# EAGLE design Adafruit PCA9685 rev C (EAGLE 6.3)
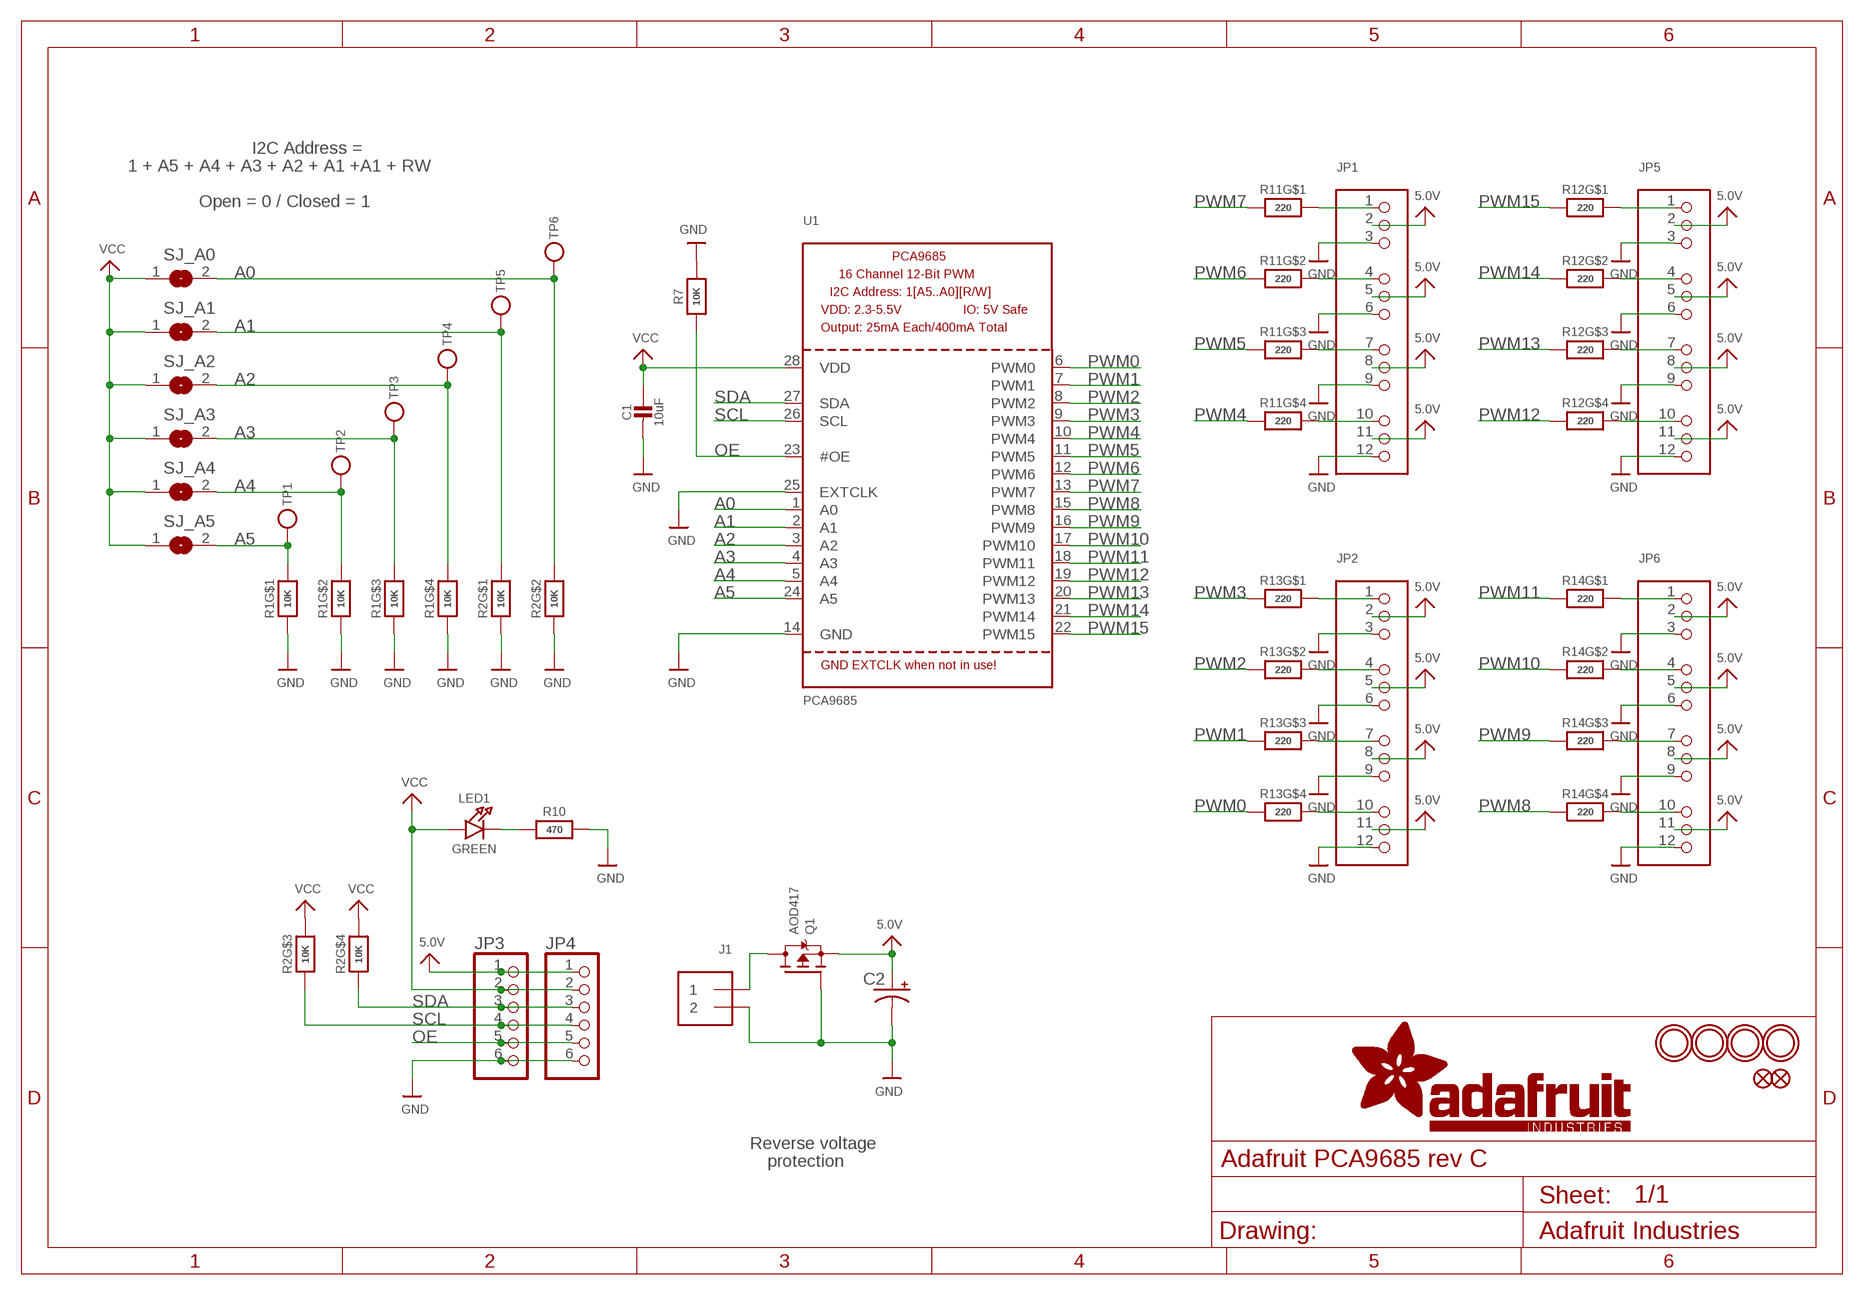
[diagram p0: schematic, sheet 1]

## Parts
C1  10uF  CAP_CERAMIC0805-NOOUTLINE  [0805-NO]
C2  CPOL-USE3.5-8  [E3,5-8]
FID1  FIDUCIAL""  [FIDUCIAL_1MM]
FID2  FIDUCIAL""  [FIDUCIAL_1MM]
J1  TERMBLOCK_1X2  [TERMBLOCK_1X2-3.5MM]
JP1  HEADER-3X04  [3X04]
JP2  HEADER-3X04  [3X04]
JP3  PINHD-1X6CB  [1X06-CLEANBIG]
JP4  PINHD-1X6CB  [1X06-CLEANBIG]
JP5  HEADER-3X04  [3X04]
JP6  HEADER-3X04  [3X04]
LED1  GREEN  LED0805_NOOUTLINE  [CHIPLED_0805_NOOUTLINE]
Q1  AOD417  MOSFET-PTO252  [TO252]
R1  10K  RESISTOR_4PACK  [RESPACK_4X0603]
R2  10K  RESISTOR_4PACK  [RESPACK_4X0603]
R7  10K  RESISTOR0805_NOOUTLINE  [0805-NO]
R10  470  RESISTOR_0805MP  [_0805MP]
R11  220  RESISTOR_4PACK  [RESPACK_4X0603]
R12  220  RESISTOR_4PACK  [RESPACK_4X0603]
R13  220  RESISTOR_4PACK  [RESPACK_4X0603]
R14  220  RESISTOR_4PACK  [RESPACK_4X0603]
SJ_A0  SOLDERJUMPERREFLOW_NOPASTE  [SOLDERJUMPER_REFLOW_NOPASTE]
SJ_A1  SOLDERJUMPERREFLOW_NOPASTE  [SOLDERJUMPER_REFLOW_NOPASTE]
SJ_A2  SOLDERJUMPERREFLOW_NOPASTE  [SOLDERJUMPER_REFLOW_NOPASTE]
SJ_A3  SOLDERJUMPERREFLOW_NOPASTE  [SOLDERJUMPER_REFLOW_NOPASTE]
SJ_A4  SOLDERJUMPERREFLOW_NOPASTE  [SOLDERJUMPER_REFLOW_NOPASTE]
SJ_A5  SOLDERJUMPERREFLOW_NOPASTE  [SOLDERJUMPER_REFLOW_NOPASTE]
TP1  TESTPOINTROUND1MM  [TESTPOINT_ROUND_1MM]
TP2  TESTPOINTROUND1MM  [TESTPOINT_ROUND_1MM]
TP3  TESTPOINTROUND1MM  [TESTPOINT_ROUND_1MM]
TP4  TESTPOINTROUND1MM  [TESTPOINT_ROUND_1MM]
TP5  TESTPOINTROUND1MM  [TESTPOINT_ROUND_1MM]
TP6  TESTPOINTROUND1MM  [TESTPOINT_ROUND_1MM]
U1  PCA9685  [TSSOP28]
U$47  MOUNTINGHOLE2.5  [MOUNTINGHOLE_2.5_PLATED]
U$48  MOUNTINGHOLE2.5  [MOUNTINGHOLE_2.5_PLATED]
U$49  MOUNTINGHOLE2.5  [MOUNTINGHOLE_2.5_PLATED]
U$50  MOUNTINGHOLE2.5  [MOUNTINGHOLE_2.5_PLATED]

## Nets
5.0V: C2.+ JP1.2 JP1.5 JP1.8 JP1.11 JP2.2 JP2.5 JP2.8 JP2.11 JP3.1 JP4.1 JP5.2 JP5.5 JP5.8 JP5.11 JP6.2 JP6.5 JP6.8 JP6.11 Q1.2(S)
A0: R2.7 SJ_A0.2 TP6.P$1 U1.1(A0)
A1: R2.8 SJ_A1.2 TP5.P$1 U1.2(A1)
A2: R1.5 SJ_A2.2 TP4.P$1 U1.3(A2)
A3: R1.6 SJ_A3.2 TP3.P$1 U1.4(A3)
A4: R1.7 SJ_A4.2 TP2.P$1 U1.5(A4)
A5: R1.8 SJ_A5.2 TP1.P$1 U1.24(A5)
GND: C1.2 C2.- J1.2 JP1.3 JP1.6 JP1.9 JP1.12 JP2.3 JP2.6 JP2.9 JP2.12 JP3.6 JP4.6 JP5.3 JP5.6 JP5.9 JP5.12 JP6.3 JP6.6 JP6.9 JP6.12 Q1.1(G) R1.1 R1.2 R1.3 R1.4 R2.1 R2.2 R7.2 R10.2 U1.14(GND) U1.25(EXTCLK)
N$1: LED1.C R10.1
N$2: JP1.4 R11.7
N$3: JP1.1 R11.8
N$4: JP1.7 R11.6
N$5: JP1.10 R11.5
N$6: JP2.1 R13.8
N$7: JP2.4 R13.7
N$8: JP2.7 R13.6
N$9: JP2.10 R13.5
N$10: JP6.10 R14.5
N$11: JP6.7 R14.6
N$12: JP6.4 R14.7
N$13: JP6.1 R14.8
N$14: JP5.10 R12.5
N$15: JP5.7 R12.6
N$16: JP5.4 R12.7
N$17: JP5.1 R12.8
OE: JP3.5 JP4.5 R7.1 U1.23(#OE)
PWM0: R13.4 U1.6(PWM0)
PWM1: R13.3 U1.7(PWM1)
PWM2: R13.2 U1.8(PWM2)
PWM3: R13.1 U1.9(PWM3)
PWM4: R11.4 U1.10(PWM4)
PWM5: R11.3 U1.11(PWM5)
PWM6: R11.2 U1.12(PWM6)
PWM7: R11.1 U1.13(PWM7)
PWM8: R14.4 U1.15(PWM8)
PWM9: R14.3 U1.16(PWM9)
PWM10: R14.2 U1.17(PWM10)
PWM11: R14.1 U1.18(PWM11)
PWM12: R12.4 U1.19(PWM12)
PWM13: R12.3 U1.20(PWM13)
PWM14: R12.2 U1.21(PWM14)
PWM15: R12.1 U1.22(PWM15)
PWRIN: J1.1 Q1.3(D)
SCL: JP3.4 JP4.4 R2.3 U1.26(SCL)
SDA: JP3.3 JP4.3 R2.4 U1.27(SDA)
VCC: C1.1 JP3.2 JP4.2 LED1.A R2.5 R2.6 SJ_A0.1 SJ_A1.1 SJ_A2.1 SJ_A3.1 SJ_A4.1 SJ_A5.1 U1.28(VDD)

## Notes on the sheet
- I2C Address =
- 1 + A5 + A4 + A3 + A2 + A1 +A1 + RW
- Open = 0 / Closed = 1
- Reverse voltage
- protection

## Library data of the parts
C1 = microbuilder:CAP_CERAMIC: Ceramic Capacitors For new designs, use the packages preceded by an '_' character since they are more reliable: The following footprints should be used on most boards: _0402 - Standard footprint for regular board layouts _0603 - Standard footprint for regular board layouts _0805 - Standard footprint for regular board layouts _1206 - Standard footprint for regular board layouts For extremely tight-pitch boards where space is at a premium, the following 'micro-pitch' footprints can be used (smaller pads, no silkscreen outline, etc.): _0402MP - Micro-pitch footprint for very dense/compact boards _0603MP - Micro-pitch footprint for very dense/compact boards _0805MP - Micro-pitch footprint for very dense/compact boards _1206MP - Micro-pitch footprint for very dense/compact boards
C2 = adafruit:CPOL-US: POLARIZED CAPACITOR, American symbol
FID1 FID2 = microbuilder:FIDUCIAL: Fiducial Alignment Points Various fiducial points for machine vision alignment.; BOM: EXCLUDE
J1 = microbuilder:TERMBLOCK_1X2: 3.5mm Terminal block http://www.ladyada.net/library/pcb/eaglelibrary.html
JP1 JP2 JP5 JP6 = microbuilder:HEADER-3X04
JP3 JP4 = adafruit:PINHD-1X6: PIN HEADER
LED1 = microbuilder:LED: LED 0603 - 0603 Surface Mount Package 2mA: Green LED - Low Power (3.9mcd, 2ma, 1.7Vf) - Digikey: 475-2709-2-ND Orange LED - Low Power (9.8mcd, 2ma, 1.8Vf) - Digikey: 475-1194-2-ND Red LED - Low Power (5mcd, 2ma, 1.8Vf) - Digikey: 475-1195-2-ND Yellow LED - Low Power (7mcd, 2ma, 1.8Vf) - Digikey: 475-1196-2-ND 5mA: Blue LED - Low Power (17mcd, 5ma, 2.9Vf) - Digikey: LNJ937W8CRACT-ND 0805 - 0805 Surface Mount Package 2mA: Red LED (8.8mcd, 2mA, 1.8Vf, Clear) - Low Power [Digikey: 475-2510-1-ND] Green LED (5mcd, 2mA, 1.8Vf, Clear) - Low Power [Digikey: 475-2730-1-ND] Yellow LED (11.3mcd, 2mA, 1.8Vf, Clear) - Low Power [Digikey: 475-2555-1-ND] 20mA: Red LED (104mcd, 20mA, Diffused) - LS R976 [Digikey: 475-1278-6-ND] Red LED (12mcd, 20mA, 2.0Vf, Clear) - APT2012EC [Digikey: 754-1128-1-ND] Green LED (15mcd, 20mA, 2.2Vf, Clear) - APT2012GC [Digikey: 754-1131-1-ND] Orange LED (160mcd, 20mA, 2.1Vf, Clear) - APT2012SECK [Digikey: 754-1130-1-ND] 1206 - 1206 Surface Mount Package Green LED (26mcd, 20mA, Diffused) - LG N971 [Digikey: 475-1407-6-ND] Red LED (15mcd, 20mA, Diffused) - LH N974 [Digikey: 475-1416-6-ND] Cree - Cree High-Power Surface Mount LEDs XPEBWT-L1-0000-00D50 - White 111lm 350mA 2.9Vf 6200K 110° XTEAWT-00-0000-00000LEE3 - White 114lm 350mA 2.85Vf 5000K 115° Everlight - Everlight 45-21 Series Surface Mount LEDs 45-21/QK2C-B2832AC2CB2/2T - Warm White 2000mcd 20mA 3.25Vf 3050K 120° 45-21/LK2C-B38452C4CB2/2T - Nuetral White 2000mcd 20mA 3.25Vf 4150K 120° 45-21/LK2C-B50634C6CB2/2T - Cold White 2200mcd 20mA 3.25Vf 5650K 120° PLCC2 Reverse Mount LS T77K-J1L2-1-0-2-R18-Z - Red 11.25mcd 2mA 1.8Vf 630nm 120° LO T77K-L1M2-24-Z - Orange 19.6mcd 2mA 1.8Vf 606nm 120° LY T77K-K2M1-26-Z - Yellow 15.7mcd 2mA 1.8Vf 587nm 120°
Q1 = microbuilder:MOSFET-P: P-Channel Mosfet LEGEND VDS: Voltage Drain-Source ID: Drain Current RDS(ON): Drain-Source On-State Resistance VGS(TH): Gate-Source Threshold Voltage CISS: Drain-Source Input Capacitance SOT-23 Name VDS ID RDS(ON) VGS(TH) CISS Order Number IRLML5103 30V 760mA 600 mOhm -- 75pF @ 25V Digikey: IRLML5103PBFCT-ND IRLML6401 12V 4.3A 50 mOhm 950mV @ 250µA 830pF @ 10V Digikey: IRLML6401PBFTR-ND NTR0202PL 20V 400mA 800 mOhm 2.3V @ 250uA 70pF @ 5V Digikey: NTR0202PLT1GOSTR-ND NTR4101PT1G 20V 1.8A 85 mOhm 1.2V @ 250uA 675pF @ 10V Digikey: NTR4101PT1GOSCT-ND DMP2004K 20V 600mA 900 mOhm 1V @ 250uA 175pF @ 16V Digikey: DMP2004KDICT-ND PMV65XP 20V 3.9A 76 mOhm 950mV @ 1mA 725pF @ 20V Digikey: 568-2358-2-ND TO-252 Name VDS ID RDS(ON) VGS(TH) CISS Order Number AOD417 30V 25A 34 mOhm 3V @ 250µA 920pF @ 15V Digikey: 785-1106-2-ND
R1 R2 R11-R14 = microbuilder:RESISTOR_4PACK: Resistor Packs (4 resistors) 4 x 0603 10K 1/16W - Digikey: YC164J-10KCT-ND
R7 R10 = microbuilder:RESISTOR: Resistors For new designs, use the packages preceded by an '_' character since they are more reliable: The following footprints should be used on most boards: _0402 - Standard footprint for regular board layouts _0603 - Standard footprint for regular board layouts _0805 - Standard footprint for regular board layouts _1206 - Standard footprint for regular board layouts For extremely tight-pitch boards where space is at a premium, the following 'micro-pitch' footprints can be used (smaller pads, no silkscreen outline, etc.): _0402MP - Micro-pitch footprint for very dense/compact boards _0603MP - Micro-pitch footprint for very dense/compact boards _0805MP - Micro-pitch footprint for very dense/compact boards _1206MP - Micro-pitch footprint for very dense/compact boards
SJ_A0 SJ_A1-SJ_A5 = microbuilder:SOLDERJUMPER: SMD Solder JUMPER Solder the two pads together to create a connection, or remove the solder to break it. REFLOW - Use this footprint for solder paste and reflow ovens. WAVE - Use this footprint for hand-soldering (larger pads). CLOSED - Has a trace between the two pads to ensure it is closed by default. The trace needs to be cut to disable the jumper, and can be closed again by creating a solder bridge between the two pads.
TP1-TP6 = microbuilder:TESTPOINT: Test Point Various test points for characterisation and PCB testing TESTPOINT_SMT - Compact Surface Mount Test Point [Digikey: 5016KTR-ND]
U1 = microbuilder:PCA9685: PCA9685 - 16 Channel 12-Bit I2C PWM Controller 5.0V tolerant 16 channel, 12-bit I2C PWM controller with 25mA per output (max. 400mA total) Digikey: 568-5931-1-ND
U$47-U$50 = microbuilder:MOUNTINGHOLE: Mounting Hole For #2 screws (0.086"/2.18mm width, 0.094"/2.4mm hole) use 2.5mm; BOM: EXCLUDE

## Board
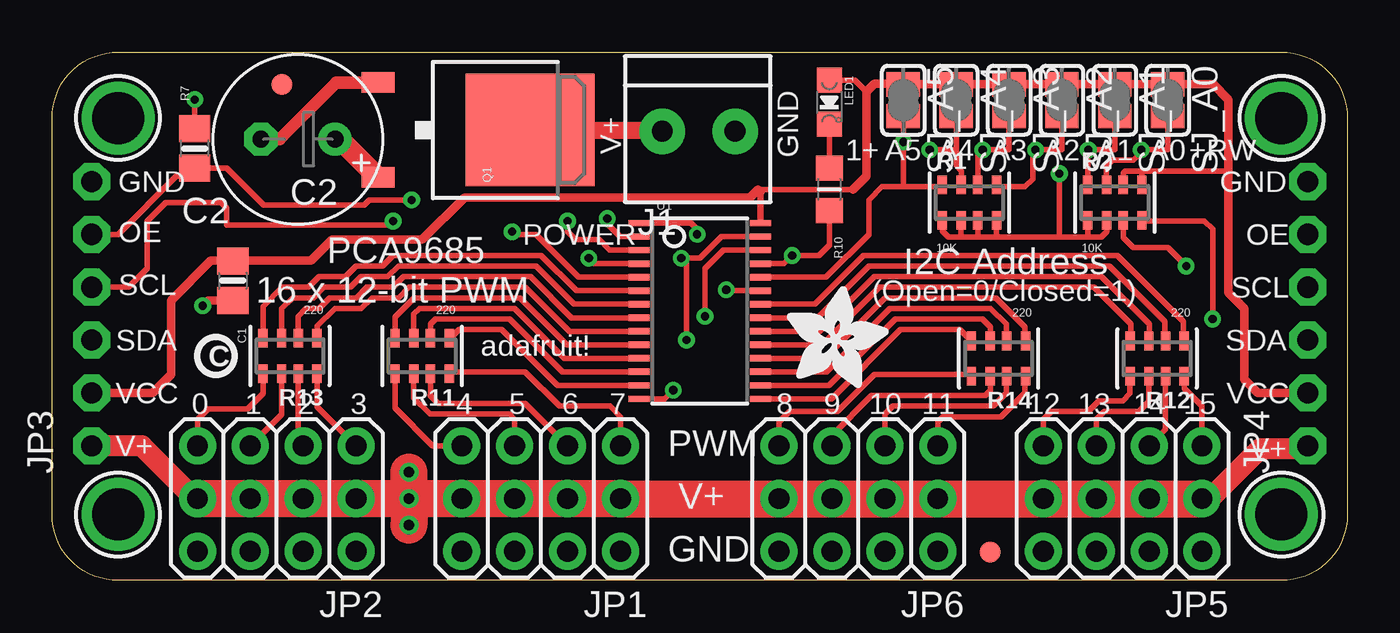
[diagram p1: board, top side]
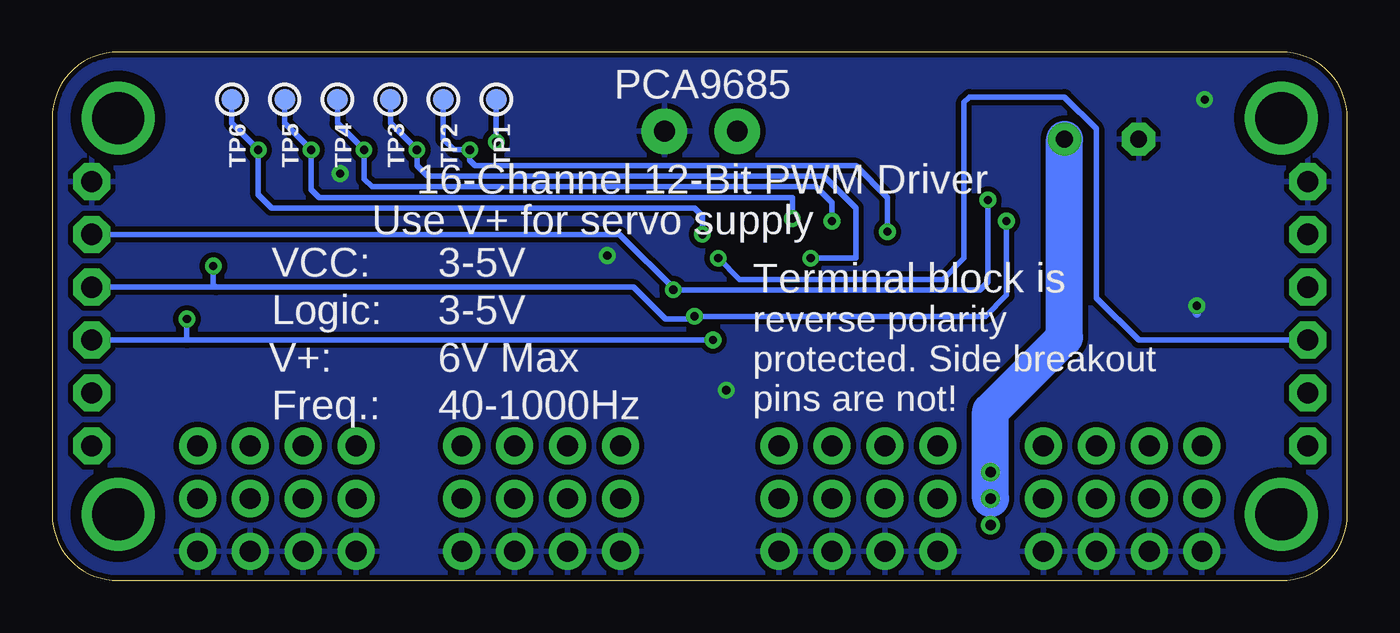
[diagram p2: board, bottom side, seen from below]

Size 62.23 x 25.4 mm. Coordinates in mm from the lower left corner, seen from the top.
Outline: 3.17,0 arc-90 0,3.18 0,22.23 arc-90 3.17,25.4 59.05,25.4 arc-90 62.23,22.23 62.23,3.18 arc-90 59.05,0 3.17,0
Copper layers (1*16): Top 0.035mm / dielectric 1.5mm / Bottom 0.035mm
Design rules "adafruit": minimum track width 8mil, minimum drill 15.5mil, track to track 8mil, track to pad 8mil, pad to pad 8mil, via to via 8mil, smd to smd 8mil, copper to edge 10mil, drill to drill 8mil, minimum pad ring 10mil, minimum via ring 8mil, stop-mask expansion 2mil, vias tented up to drill 20mil, thermal gap 10mil

### Footprints (pad centres in the part's own frame; a part is rotated, then mirrored left to right if it is on the bottom)
0805-NO = smd 1.3 x 1.5: 1 -0.95,0; 2 0.95,0
E3,5-8 = drill 0.813 pad 1.6: + -1.778,0 | drill 0.813 pad 1.6 octagon: - 1.778,0
FIDUCIAL_1MM = smd 1 x 1: 1 0,0
TERMBLOCK_1X2-3.5MM = drill 1 pad 2.184: 1 1.8,0; 2 -1.7,0
3X04 = drill 1 pad 1.778: 1 -3.81,-2.54; 2 -3.81,0; 3 -3.81,2.54; 4 -1.27,-2.54; 5 -1.27,0; 6 -1.27,2.54; 7 1.27,-2.54; 8 1.27,0; 9 1.27,2.54; 10 3.81,-2.54; 11 3.81,0; 12 3.81,2.54
1X06-CLEANBIG = drill 1.016 pad 1.778 octagon: 1 -6.35,0; 2 -3.81,0; 3 -1.27,0; 4 1.27,0; 5 3.81,0; 6 6.35,0
CHIPLED_0805_NOOUTLINE = smd 1.2 x 1.2: A 0,-1.05; C 0,1.05
TO252 = smd 1 x 1.6: 1 -2.28,-4.8; 2 2.28,-4.8 | smd 5.4 x 6.2: 3 0,2.5
RESPACK_4X0603 = smd 0.45 x 0.9: 1 -1.3,-0.85; 2 -0.4,-0.85; 3 0.4,-0.85; 4 1.3,-0.85; 5 1.3,0.85; 6 0.4,0.85; 7 -0.4,0.85; 8 -1.3,0.85
_0805MP = smd 1.2 x 1.3: 1 -1.016,0; 2 1.016,0
SOLDERJUMPER_REFLOW_NOPASTE = smd 1.168 x 1.6: 1 -0.762,0; 2 0.762,0
TESTPOINT_ROUND_1MM = smd 1 x 1: P$1 0,0
TSSOP28 = smd 0.305 x 0.991: 1 -4.225,-2.918; 2 -3.575,-2.918; 3 -2.925,-2.918; 4 -2.275,-2.918; 5 -1.625,-2.918; 6 -0.975,-2.918; 7 -0.325,-2.918; 8 0.325,-2.918; 9 0.975,-2.918; 10 1.625,-2.918; 11 2.275,-2.918; 12 2.925,-2.918; 13 3.575,-2.918; 14 4.225,-2.918; 15 4.225,2.918; 16 3.575,2.918; 17 2.925,2.918; 18 2.275,2.918; 19 1.625,2.918; 20 0.975,2.918; 21 0.325,2.918; 22 -0.325,2.918; 23 -0.975,2.918; 24 -1.625,2.918; 25 -2.275,2.918; 26 -2.925,2.918; 27 -3.575,2.918; 28 -4.225,2.918
MOUNTINGHOLE_2.5_PLATED = drill 2.5 pad 3.2: P$1 0,0

### Placement (x,y rotation side)
C1  8.68,14.41 270 top
C2  11.81,21.21 180 top
FID1  45.07,1.37 0 top
FID2  11.05,23.85 0 top
J1  31.12,21.59 180 top
JP1  23.5,3.94 180 top
JP2  10.79,3.94 180 top
JP3  1.91,12.83 90 top
JP4  60.33,12.83 90 top
JP5  51.44,3.94 180 top
JP6  38.73,3.94 180 top
LED1  37.34,22.99 180 top
Q1  20.46,21.66 270 top
R1  44.07,18.16 0 top
R2  51.05,18.16 0 top
R7  6.86,20.76 90 top
R10  37.34,18.8 270 top
R11  17.78,10.79 180 top
R12  53.09,10.67 180 top
R13  11.43,10.79 180 top
R14  45.47,10.67 180 top
SJ_A0  53.59,23.08 270 top
SJ_A1  51.05,23.08 270 top
SJ_A2  48.51,23.08 270 top
SJ_A3  45.97,23.08 270 top
SJ_A4  43.43,23.08 270 top
SJ_A5  40.89,23.08 270 top
TP1  40.89,23.11 270 bottom
TP2  43.43,23.11 270 bottom
TP3  45.97,23.11 270 bottom
TP4  48.51,23.11 270 bottom
TP5  51.05,23.11 270 bottom
TP6  53.59,23.11 270 bottom
U1  31.12,12.95 270 top
U$47  3.17,22.23 0 top
U$48  3.17,3.18 0 top
U$49  59.05,22.23 0 top
U$50  59.05,3.18 0 top
U$51  [ADAFRUIT_5MM]  35.31,9.27 0 top
U$54  [PCBFEAT-REV-040]  7.87,10.79 0 top

### Tracks (layer width: path | path; a pad name or v marks a point on that pad's centre or on a via)
5.0V  (via drill 0.5)
  Top 0.254: JP2.11 6.86,3.94 | JP5.2 55.63,3.94
  Top 1.016: JP3.1 4.32,6.48 6.86,3.94 | 55.63,3.94 58.04,6.35 60.2,6.35 JP4.1 | Q1.2 13.83,21.21 C2.+
  Top 1.778: JP2.11 JP2.8 JP2.5 JP2.2 v17.14,3.94 | v17.14,3.94 JP1.11 JP1.8 JP1.5 JP1.2 JP6.11 JP6.8 JP6.5 JP6.2 JP5.11 JP5.8 JP5.5 JP5.2 | v17.14,3.94 v17.14,5.21 | v17.14,3.94 v17.14,2.67
  Bottom 1.778: C2.+ 13.59,11.68 17.14,8.13 v17.14,3.94
A0  (via drill 0.39)
  Top 0.254: SJ_A0.2 53.59,20.7 v52.32,20.7 52.32,20.57 51.94,20.19 50.93,20.19 50.65,19.92 R2.7 | v30.99,16.64 30.99,16.89 30.7,17.18 U1.1
  Bottom 0.254: v30.99,16.64 30.99,17.53 31.37,17.91 51.69,17.91 52.32,18.54 v52.32,20.7 53.59,21.97 TP6.P$1
A1  (via drill 0.39)
  Top 0.254: SJ_A1.2 51.05,20.7 v49.78,20.7 49.75,20.67 R2.8 | U1.2 27.29,16.53 26.67,17.14 v26.67,17.4
  Bottom 0.254: v26.67,17.4 26.67,18.41 49.4,18.41 49.78,18.8 v49.78,20.7 51.05,21.97 TP5.P$1
A2  (via drill 0.39)
  Top 0.254: SJ_A2.2 48.51,20.7 v47.24,20.7 47.12,20.57 47.12,19.3 46.74,18.92 45.46,18.92 R1.5 | U1.3 26.79,15.88 26.29,16.38 25.15,16.38 24.77,16.76 v24.77,17.27
  Bottom 0.254: v24.77,17.27 24.77,18.16 25.53,18.92 46.86,18.92 47.24,19.3 v47.24,20.7 48.51,21.97 TP4.P$1
A3  (via drill 0.39)
  Top 0.254: SJ_A3.2 45.97,20.7 v44.7,20.7 44.47,20.47 R1.6 | U1.4 26.05,15.23 v25.78,15.49
  Bottom 0.254: v25.78,15.49 23.62,15.49 23.62,17.91 25.15,19.43 44.2,19.43 44.7,19.94 v44.7,20.7 45.97,21.97 TP3.P$1
A4  (via drill 0.39)
  Top 0.254: 43.43,20.7 SJ_A4.2 | v42.16,20.7 43.43,20.7 | U1.5 25.3,14.58 23.24,16.64 22.23,16.64 v22.1,16.76 | 43.43,20.7 43.43,19.94 43.69,19.69 43.69,19.03 R1.7
  Bottom 0.254: v22.1,16.76 22.1,18.41 23.62,19.94 41.91,19.94 42.16,20.19 v42.16,20.7 42.93,20.7 43.43,21.21 TP2.P$1
A5  (via drill 0.39)
  Top 0.254: U1.24 37.19,14.58 39.24,16.64 39.24,18.29 39.88,18.92 40.89,18.92 | SJ_A5.2 v40.89,21.08 40.89,18.92 | 40.89,18.92 42.68,18.92 R1.8
  Bottom 0.254: TP1.P$1 v40.89,21.08
GND  (via drill 0.39)
  Top 0.254: v6.86,23.11 R7.2 | U1.14 29.43,8.73 v29.85,9.14 | U1.25 35.17,15.23 v35.56,15.62 36.83,15.62 37.34,16.13 R10.2 | R1.1 42.77,16.79 43.05,16.51 43.69,16.51 | 43.69,16.51 44.45,16.51 | 44.45,16.51 45.47,16.51 | 45.47,16.51 48.39,16.51 | 48.39,16.51 49.78,16.51 | 49.78,16.51 50.42,16.51 50.67,16.76 50.67,17.29 R2.2 | v48.39,19.56 48.39,16.51 | R2.1 49.75,16.54 49.78,16.51 | R1.2 43.67,16.53 43.69,16.51 | R1.3 44.47,16.53 44.45,16.51 | R1.4 45.37,16.61 45.47,16.51
  Top 0.406: C1.2 7.5,13.46 v7.24,13.21
  Top 0.61: Q1.1 13.65,23.93 10.92,21.21 C2.-
  Bottom 0.254: v35.56,15.62 35.81,15.62
  Bottom 0.406: v7.24,13.21 7.24,12.83
  pour Bottom (isolate 0.254): 0,0 0,25.94 62.78,25.94 62.78,0
N$1
  Top 0.254: R10.1 LED1.C
N$2
  Top 0.254: JP1.4 22.73,8.51 18.54,8.51 18.16,8.89 18.18,8.91 R11.7
N$3
  Top 0.254: JP1.1 27.3,7.87 26.8,8.38 24.38,8.38 22.73,10.03 19.17,10.03 R11.8
N$4
  Top 0.254: JP1.7 22.23,7.75 21.97,8 18.16,8 17.38,8.78 R11.6
N$5
  Top 0.254: JP1.10 18.29,6.48 16.48,8.29 R11.5
N$6
  Top 0.254: JP2.1 12.73,8.35 R13.8
N$7
  Top 0.254: R13.7 11.83,6.71 JP2.4
N$8
  Top 0.254: R13.6 11.03,7.98 JP2.7
N$9
  Top 0.254: R13.5 10.13,8.99 9.4,8.26 7.49,8.26 6.99,7.75 JP2.10
N$10
  Top 0.254: JP6.10 34.93,7.62 35.43,8.13 37.72,8.13 39.5,9.91 44.17,9.91 R14.5
N$11
  Top 0.254: JP6.7 37.47,6.99 39.37,8.89 44.83,8.89 45.09,9.14 45.09,9.8 R14.6
N$12
  Top 0.254: JP6.4 40.01,8 40.39,8.38 45.21,8.38 45.85,9.02 45.85,9.8 R14.7
N$13
  Top 0.254: JP6.1 42.55,7.62 42.8,7.87 45.59,7.87 46.74,9.02 46.74,9.79 R14.8
N$14
  Top 0.254: R12.5 51.79,8.99 51.44,8.64 50.29,8.64 49.78,8.13 48.01,8.13 47.62,7.75 JP5.10
N$15
  Top 0.254: R12.6 52.69,8.62 52.2,8.13 50.55,8.13 50.16,7.75 JP5.7
N$16
  Top 0.254: R12.7 53.49,7.26 JP5.4
N$17
  Top 0.254: JP5.1 55.25,8.38 54.39,9.24 R12.8
OE  (via drill 0.39)
  Top 0.254: JP3.5 3.17,16.64 5.97,19.43 6.86,19.43 | U1.23 32.43,13.93 v32.38,13.97 | 6.98,19.43 6.86,19.43 | 6.86,19.43 R7.1 8.38,19.81 10.16,18.04 14.98,18.04 15.23,18.29 v17.27,18.29
  Bottom 0.254: JP4.5 34.97,16.64 32.26,13.93 32.43,13.93 v32.38,13.97 17.65,13.97 17.27,14.35 v17.27,18.29
PWM0
  Top 0.254: U1.6 25.19,13.93 23.5,15.62 16.38,15.62 15.88,15.11 14.6,15.11 14.1,14.61 12.83,14.61 12.32,14.1 11.05,14.1 10.13,13.18 R13.4
PWM1
  Top 0.254: U1.7 25.08,13.28 23.24,15.11 16.64,15.11 16.13,14.61 14.86,14.61 14.35,14.1 13.08,14.1 12.57,13.59 11.56,13.59 11.03,13.06 R13.3
PWM2
  Top 0.254: U1.8 24.96,12.63 22.99,14.61 16.89,14.61 16.38,14.1 15.11,14.1 14.6,13.59 13.33,13.59 12.83,13.08 12.19,13.08 11.81,12.7 11.83,12.68 R13.2
PWM3
  Top 0.254: U1.9 24.85,11.98 22.73,14.1 17.14,14.1 16.64,13.59 15.37,13.59 14.86,13.08 13.59,13.08 12.73,12.22 R13.1
PWM4
  Top 0.254: U1.10 24.74,11.33 22.48,13.59 17.4,13.59 16.48,12.67 R11.4
PWM5
  Top 0.254: U1.11 24.63,10.68 22.23,13.08 17.65,13.08 17.38,12.81 R11.3
PWM6
  Top 0.254: U1.12 24.52,10.03 21.97,12.57 18.42,12.57 18.18,12.34 R11.2
PWM7
  Top 0.254: U1.13 24.28,9.38 21.59,12.07 19.56,12.07 19.08,11.59 R11.1
PWM8
  Top 0.254: U1.15 37.43,8.73 40.77,12.07 43.62,12.07 R14.4
PWM9
  Top 0.254: U1.16 37.32,9.38 40.51,12.57 44.7,12.57 45.09,12.19 45.09,11.54 R14.3
PWM10
  Top 0.254: U1.17 37.21,10.03 40.26,13.08 45.09,13.08 45.85,12.32 45.85,11.54 R14.2
PWM11
  Top 0.254: U1.18 37.09,10.68 40.01,13.59 45.34,13.59 46.74,12.19 46.74,11.55 R14.1
PWM12
  Top 0.254: U1.19 36.98,11.33 39.75,14.1 50.04,14.1 51.82,12.32 51.82,11.55 R12.4
PWM13
  Top 0.254: U1.20 36.87,11.98 39.5,14.61 50.42,14.61 52.7,12.32 52.7,11.54 R12.3
PWM14
  Top 0.254: U1.21 36.76,12.63 39.24,15.11 50.8,15.11 53.47,12.45 53.47,11.54 R12.2
PWM15
  Top 0.254: U1.22 36.65,13.28 38.99,15.62 51.18,15.62 54.36,12.45 54.36,11.55 R12.1
PWRIN
  Top 0.813: Q1.3 29.25,21.66 J1.1
SCL  (via drill 0.39)
  Top 0.254: JP3.4 3.68,14.1 4.57,14.99 4.57,17.27 5.46,18.16 8.13,18.16 8.38,17.91 8.38,17.09 16.21,17.09 v16.38,17.27 | v31.37,12.7 31.37,14.99 32.26,15.88 U1.26 | R2.3 51.45,16.49 51.94,16 53.59,16 v54.48,15.11
  Bottom 0.254: 54.36,14.1 34.29,14.1 32.77,12.57 31.5,12.57 v31.37,12.7 17.4,12.7 16.38,13.72 v16.38,17.27 | 54.36,14.1 JP4.4 | v54.48,15.11 54.48,14.22 54.36,14.1
SDA  (via drill 0.39)
  Top 0.254: U1.27 32.15,16.53 31.12,15.49 v30.23,15.49 30.48,15.24 v30.48,11.56 | v55.75,12.57 55.75,16.89 55.36,17.28 52.38,17.28 R2.4
  Bottom 0.254: v30.48,11.56 55.75,11.56 | 55.75,11.56 JP4.3 | JP3.3 10.03,11.56 12.06,13.59 12.06,21.72 13.59,23.24 18.16,23.24 18.42,22.99 18.42,15.49 19.43,14.48 29.21,14.48 v30.23,15.49 | v55.75,12.57 55.75,11.56
VCC
  Top 0.254: 33.91,18.8 38.48,18.8 | R2.6 51.45,19.58 51.56,19.69 52.32,19.69 | 52.32,19.69 56.39,19.69 56.52,19.56 | R2.5 52.35,19.66 52.32,19.69 | LED1.A 38.57,24.04 39.12,23.5
  Top 0.305: 34.03,18.67 U1.28
  Top 0.406: JP3.2 4.83,9.02 5.71,9.91 5.71,13.46 7.62,15.37 C1.1 | 38.48,18.8 39.12,19.43 39.12,23.5 39.5,23.88 40.86,23.88 SJ_A5.1 SJ_A4.1 SJ_A3.1 SJ_A2.1 SJ_A1.1 SJ_A0.1 55.79,23.84 56.52,23.11 56.52,19.56 56.52,13.84 57.28,13.08 57.28,9.65 57.91,9.02 JP4.2 | 34.03,18.67 33.91,18.8 33.53,18.41 19.81,18.41 17.78,16.38 13.46,16.38 12.45,15.37 C1.1 | C1.1

### Text on the board
tPlace: V+ | GND | 1+ | A5 | A4 | A3 | A2 | A1 | A0 | +RW | GND | GND | C2 | OE | OE | POWER | PCA9685 | I2C Address | SCL | SCL | 16 x 12-bit PWM | (Open=0/Closed=1) | SDA | SDA | adafruit! | VCC | VCC | 0 | 1 | 2 | 3 | 4 | 5 | 6 | 7 | 8 | 9 | 10 | 11 | 12 | 13 | 14 | 15 | V+ | V+ | PWM | V+ | GND
bPlace: PCA9685 | 16-Channel 12-Bit PWM Driver | Use V+ for servo supply | 3-5V | VCC: | Terminal block is | 3-5V | Logic: | reverse polarity | protected. Side breakout | 6V Max | V+: | pins are not! | 40-1000Hz | Freq.:
tValues: 10K | 10K | 220 ohm | 220 ohm